# EAGLE design LoggerAVR (EAGLE 7.2.0)
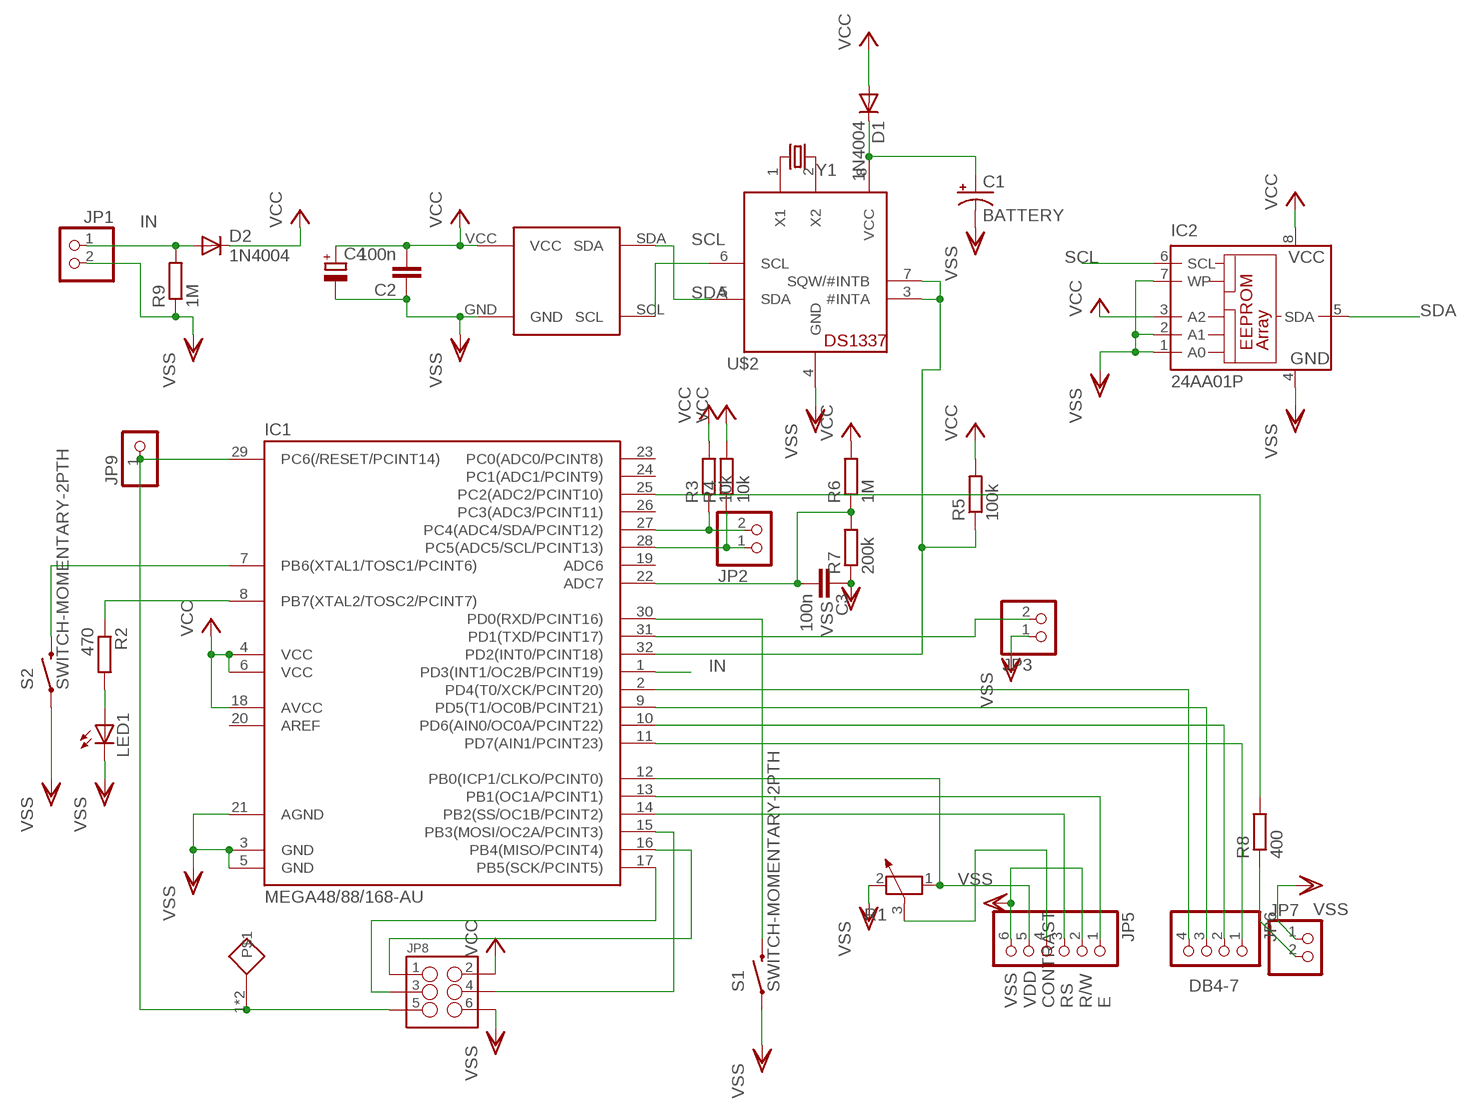
[diagram p0: schematic, sheet 1]

## Parts
C1  BATTERY  CPOL-USETR2  [ETR2]
C2  100n  C-EUC1206  [C1206]
C3  100n  C-EUC1206  [C1206]
C4  CPOL-EUE22-9AXIAL  [E22-9]
D1  1N4004  [DO41-10]
D2  1N4004  [DO41-10]
IC1  MEGA48/88/168-AU  [TQFP32-08]
IC2  24AA01P  [DIL8]
JP1  PINHD-1X2  [1X02]
JP2  PINHD-1X2  [1X02]
JP3  PINHD-1X2  [1X02]
JP5  PINHD-1X6  [1X06]
JP6  PINHD-1X4  [1X04]
JP7  PINHD-1X2  [1X02]
JP8  M03X2SHROUD  [2X3-SHROUDED]
JP9  PINHD-1X1  [1X01]
LED1  LEDSML1206  [SML1206]
R1  POTENTIOMETER_PT-10  [PT-10]
R2  470  R-EU_M1206  [M1206]
R3  10k  R-EU_M1206  [M1206]
R4  10k  R-EU_M1206  [M1206]
R5  100k  R-EU_M1206  [M1206]
R6  1M  R-EU_M1206  [M1206]
R7  200k  R-EU_M1206  [M1206]
R8  400  R-EU_M1206  [M1206]
R9  1M  R-EU_M1206  [M1206]
S1  SWITCH-MOMENTARY-2PTH  [TACTILE-PTH]
S2  SWITCH-MOMENTARY-2PTH  [TACTILE-PTH]
U$1  HYT939  [TO39]
U$2  DS1337  [DIL08-ROUND]
U$3  0 - Jump  O-OHMJUMPER  [R1206]
Y1  CRYSTAL32-SMD  [CRYSTAL-32KHZ-SMD]

## Nets
IN: D2.A IC1.1(PD3(INT1/OC2B/PCINT19)) JP1.1 R9.2
N$1: IC1.2(PD4(T0/XCK/PCINT20)) JP6.4
N$2: IC1.30(PD0(RXD/PCINT16)) S1.3 S1.4
N$3: IC1.9(PD5(T1/OC0B/PCINT21)) JP6.3
N$4: IC1.15(PB3(MOSI/OC2A/PCINT3)) JP8.4
N$5: IC1.16(PB4(MISO/PCINT4)) JP8.1
N$6: IC1.17(PB5(SCK/PCINT5)) JP8.3
N$7: IC1.29(PC6(/RESET/PCINT14)) JP8.5 JP9.1 U$3.1 U$3.2
N$8: IC1.10(PD6(AIN0/OC0A/PCINT22)) JP6.2
N$9: U$2.2(X2) Y1.X2
N$10: JP5.4 R1.3
N$11: IC1.11(PD7(AIN1/PCINT23)) JP6.1
N$12: IC1.13(PB1(OC1A/PCINT1)) JP5.1
N$13: IC1.14(PB2(SS/OC1B/PCINT2)) JP5.3
N$14: IC1.31(PD1(TXD/PCINT17)) JP3.2
N$15: IC1.7(PB6(XTAL1/TOSC1/PCINT6)) S2.3 S2.4
N$16: IC1.12(PB0(ICP1/CLKO/PCINT0)) JP5.5 R1.1
N$17: U$2.1(X1) Y1.X1
N$18: IC1.32(PD2(INT0/PCINT18)) R5.1 U$2.3(#INTA) U$2.7(SQW/#INTB)
N$19: IC1.8(PB7(XTAL2/TOSC2/PCINT7)) R2.1
N$20: LED1.A R2.2
N$21: C3.2 IC1.22(ADC7) R6.1 R7.2
N$22: C1.+ D1.C U$2.8(VCC)
N$23: IC1.25(PC2(ADC2/PCINT10)) R8.2
N$25: JP7.2 R8.1
SCL: IC1.28(PC5(ADC5/SCL/PCINT13)) IC2.6(SCL) JP2.1 R4.1 U$1.SCL U$2.6(SCL)
SDA: IC1.27(PC4(ADC4/SDA/PCINT12)) IC2.5(SDA) JP2.2 R3.1 U$1.SDA U$2.5(SDA)
VCC: C2.2 C4.+ D1.A D2.C IC1.4(VCC) IC1.6(VCC) IC1.18(AVCC) IC2.3(A2) IC2.8(VCC) JP8.2 R3.2 R4.2 R5.2 R6.2 U$1.VCC
VSS: C1.- C2.1 C3.1 C4.- IC1.3(GND) IC1.5(GND) IC1.21(AGND) IC2.1(A0) IC2.2(A1) IC2.4(GND) IC2.7(WP) JP1.2 JP3.1 JP5.2 JP5.6 JP7.1 JP8.6 LED1.C R1.2 R7.1 R9.1 S1.1 S1.2 S2.1 S2.2 U$1.GND U$2.4(GND)
Unconnected: IC1.19(ADC6) IC1.20(AREF) IC1.23(PC0(ADC0/PCINT8)) IC1.24(PC1(ADC1/PCINT9)) IC1.26(PC3(ADC3/PCINT11))

## Notes on the sheet
- DB4-7
- VSS
  VDD
  CONTRAST
  RS
  R/W
  E

## Library data of the parts
C1 = resistor:CPOL-US: POLARIZED CAPACITOR, American symbol
C2 C3 = rcl:C-EU: CAPACITOR, European symbol
C4 = rcl:CPOL-EU: POLARIZED CAPACITOR, European symbol
D1 D2 = adafruit:1N4004: DIODE General purpose 1N400x type rectifier (With bigger pads) http://www.ladyada.net/library/pcb/eaglelibrary.html
IC1 = avr-7:MEGA48/88/168
IC2 = microchip-5:24*: Serial EEPROM I2C
JP1-JP3 JP7 = pinhead:PINHD-1X2: PIN HEADER
JP5 = pinhead:PINHD-1X6: PIN HEADER
JP6 = pinhead:PINHD-1X4: PIN HEADER
JP8 = SparkFun-Connectors:M03X2: 2x3 .1" header. Shrouded, with keying- CONN-10681 SMT- CONN-11415 Pogo pins- HW-11044; PROD_ID: CONN-10681
JP9 = pinhead:PINHD-1X1: PIN HEADER
LED1 = led:LED: LED OSRAM: - CHIPLED LG R971, LG N971, LY N971, LG Q971, LY Q971, LO R971, LY R971 LH N974, LH R974 LS Q976, LO Q976, LY Q976 LO Q996 - Hyper CHIPLED LW Q18S LB Q993, LB Q99A, LB R99A - SideLED LS A670, LO A670, LY A670, LG A670, LP A670 LB A673, LV A673, LT A673, LW A673 LH A674 LY A675 LS A676, LA A676, LO A676, LY A676, LW A676 LS A679, LY A679, LG A679 - Hyper Micro SIDELED® LS Y876, LA Y876, LO Y876, LY Y876 LT Y87S - SmartLED LW L88C, LW L88S LB L89C, LB L89S, LG L890 LS L89K, LO L89K, LY L89K LS L896, LA L896, LO L896, LY L896 - TOPLED LS T670, LO T670, LY T670, LG T670, LP T670 LSG T670, LSP T670, LSY T670, LOP T670, LYG T670 LG T671, LOG T671, LSG T671 LB T673, LV T673, LT T673, LW T673 LH T674 LS T676, LA T676, LO T676, LY T676, LB T676, LH T676, LSB T676, LW T676 LB T67C, LV T67C, LT T67C, LS T67K, LO T67K, LY T67K, LW E67C LS E67B, LA E67B, LO E67B, LY E67B, LB E67C, LV E67C, LT E67C LW T67C LS T679, LY T679, LG T679 LS T770, LO T770, LY T770, LG T770, LP T770 LB T773, LV T773, LT T773, LW T773 LH T774 LS E675, LA E675, LY E675, LS T675 LS T776, LA T776, LO T776, LY T776, LB T776 LHGB T686 LT T68C, LB T68C - Hyper Mini TOPLED® LB M676 - Mini TOPLED Santana® LG M470 LS M47K, LO M47K, LY M47K Source: http://www.osram.convergy.de LUXEON: - LUMILED® LXK2-PW12-R00, LXK2-PW12-S00, LXK2-PW14-U00, LXK2-PW14-V00 LXK2-PM12-R00, LXK2-PM12-S00, LXK2-PM14-U00 LXK2-PE12-Q00, LXK2-PE12-R00, LXK2-PE12-S00, LXK2-PE14-T00, LXK2-PE14-U00 LXK2-PB12-K00, LXK2-PB12-L00, LXK2-PB12-M00, LXK2-PB14-N00, LXK2-PB14-P00, LXK2-PB14-Q00 LXK2-PR12-L00, LXK2-PR12-M00, LXK2-PR14-Q00, LXK2-PR14-R00 LXK2-PD12-Q00, LXK2-PD12-R00, LXK2-PD12-S00 LXK2-PH12-R00, LXK2-PH12-S00 LXK2-PL12-P00, LXK2-PL12-Q00, LXK2-PL12-R00 Source: www.luxeon.com KINGBRIGHT: KA-3528ASYC Source: www.kingbright.com
R1 = rcl:POTENTIOMETER_: Potentiometer
R2-R9 = rcl:R-EU_: RESISTOR, European symbol
S1 S2 = SparkFun-Electromechanical:SWITCH-MOMENTARY-2: Various NO switches- pushbuttons, reed, etc
U$1 = HYT939:HYT939
U$2 = adafruit:DS1337: DS1337 - Maxim RTC without battery backup
U$3 = rcl:O-OHMJUMPER
Y1 = SparkFun-FreqCtrl:CRYSTAL: Various standard crystals. Proven footprints. Spark Fun Electronics SKU : COM-00534; PROD_ID: XTAL-07894

## Board
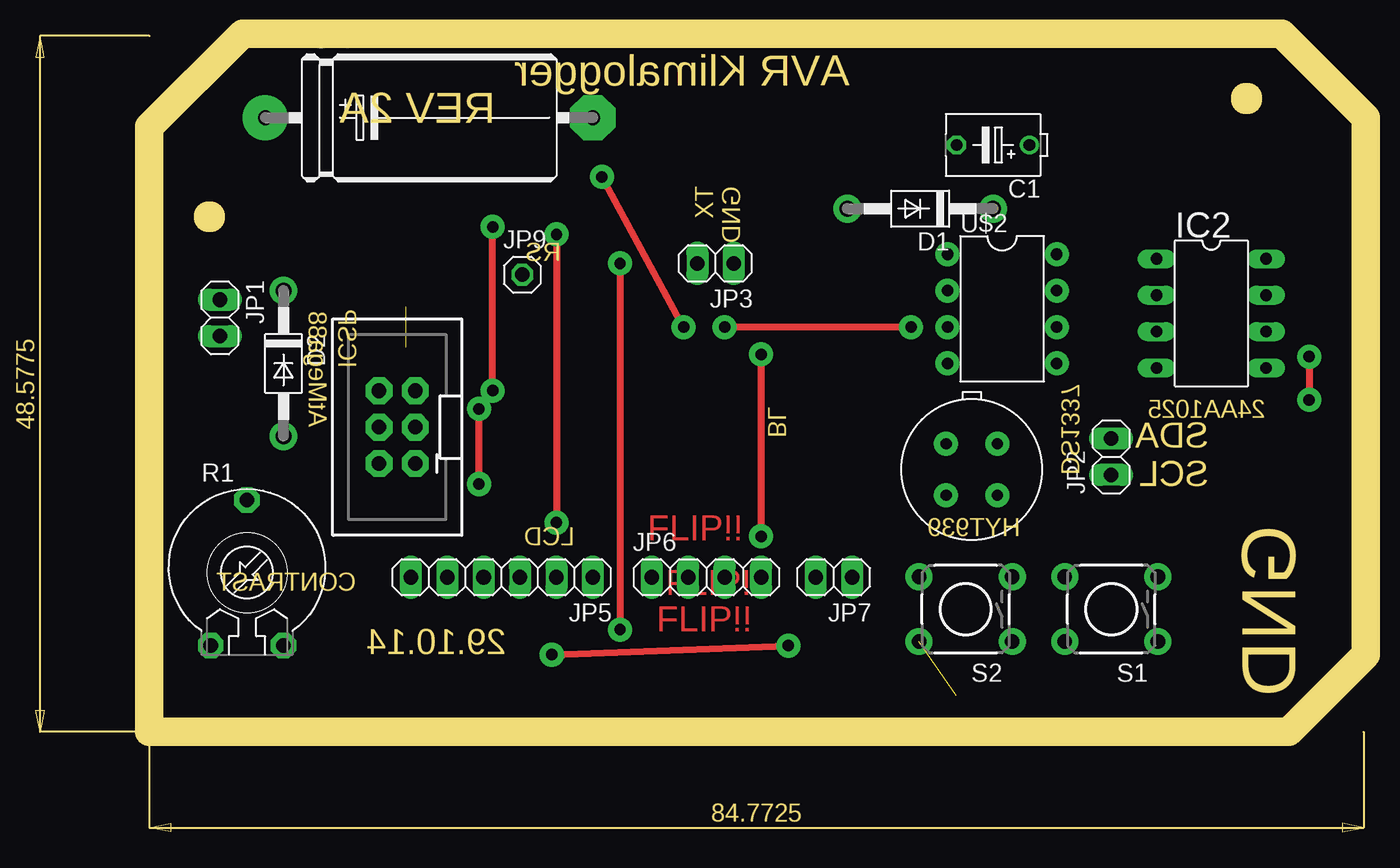
[diagram p1: board, top side]
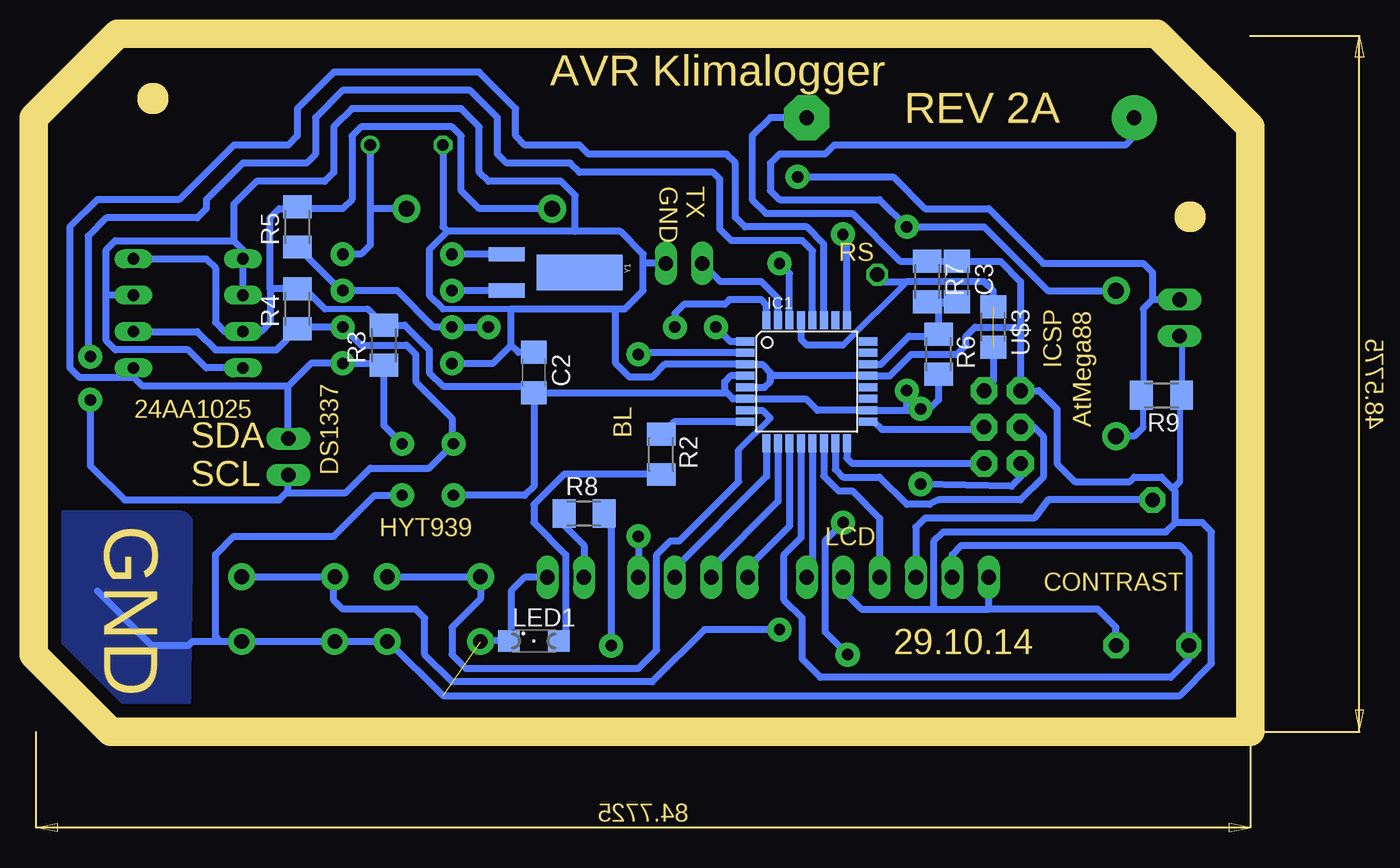
[diagram p2: board, bottom side, seen from below]

Size 83.34 x 47.15 mm. Coordinates in mm from the lower left corner, seen from the top.
Outline: 6.03,47.15 77.95,47.15 83.34,41.75 83.34,4.92 78.42,0 0,0 0,41.12 6.03,47.15
Copper layers (1*16): Top 0.035mm / dielectric 1.5mm / Bottom 0.035mm
Design rules "default": minimum track width 10mil, minimum drill 24mil, track to track 8mil, track to pad 8mil, pad to pad 8mil, via to via 8mil, smd to smd 8mil, copper to edge 40mil, drill to drill 8mil, minimum pad ring 10mil, minimum via ring 8mil, stop-mask expansion 4mil, vias tented up to drill 0mil, thermal gap 10mil
Milling: 15 lines

### Footprints (pad centres in the part's own frame; a part is rotated, then mirrored left to right if it is on the bottom)
ETR2 = drill 0.813: + -2.54,0 | drill 0.813 octagon: - 2.54,0
C1206 = smd 1.6 x 1.8: 1 -1.4,0; 2 1.4,0
E22-9 = drill 1.016 pad 3.15: + -11.43,0 | drill 1.016 pad 3.15 octagon: - 11.43,0
DO41-10 = drill 1.118 pad 1.93: A 5.08,0; C -5.08,0
TQFP32-08 = smd 1.27 x 0.559: 1 -4.293,2.8; 2 -4.293,2; 3 -4.293,1.2; 4 -4.293,0.4; 5 -4.293,-0.4; 6 -4.293,-1.2; 7 -4.293,-2; 8 -4.293,-2.8; 17 4.293,-2.8; 18 4.293,-2; 19 4.293,-1.2; 20 4.293,-0.4; 21 4.293,0.4; 22 4.293,1.2; 23 4.293,2; 24 4.293,2.8 | smd 0.559 x 1.27: 9 -2.8,-4.293; 10 -2,-4.293; 11 -1.2,-4.293; 12 -0.4,-4.293; 13 0.4,-4.293; 14 1.2,-4.293; 15 2,-4.293; 16 2.8,-4.293; 25 2.8,4.293; 26 2,4.293; 27 1.2,4.293; 28 0.4,4.293; 29 -0.4,4.293; 30 -1.2,4.293; 31 -2,4.293; 32 -2.8,4.293
DIL8 = drill 0.813 long: 1 -3.81,-3.81; 2 -1.27,-3.81; 3 1.27,-3.81; 4 3.81,-3.81; 5 3.81,3.81; 6 1.27,3.81; 7 -1.27,3.81; 8 -3.81,3.81
1X02 = drill 1.016 long: 1 -1.27,0; 2 1.27,0
1X06 = drill 1.016 long: 1 -6.35,0; 2 -3.81,0; 3 -1.27,0; 4 1.27,0; 5 3.81,0; 6 6.35,0
1X04 = drill 1.016 long: 1 -3.81,0; 2 -1.27,0; 3 1.27,0; 4 3.81,0
2X3-SHROUDED = drill 1.016 pad 1.88 octagon: 1 -1.27,2.54; 2 1.27,2.54; 3 -1.27,0; 4 1.27,0; 5 -1.27,-2.54; 6 1.27,-2.54
1X01 = drill 1.016 octagon: 1 0,0
SML1206 = smd 1.5 x 1.5: A 1.75,0; C -1.75,0
PT-10 = drill 1.016 pad 1.778 octagon: 1 -2.54,-5.08; 2 2.54,-5.08; 3 0,5.08
M1206 = smd 1.6 x 2: 1 -1.4,0; 2 1.4,0
TACTILE-PTH = drill 1.016 pad 1.88: 1 -3.251,2.261; 2 3.251,2.261; 3 -3.251,-2.261; 4 3.251,-2.261
TO39 = drill 0.8 pad 1.676: GND 2.213,-2.213; SCL -1.379,1.379; SDA 2.213,1.379; VCC -1.379,-2.213
DIL08-ROUND = drill 0.813 pad 1.676: 1 -3.81,-3.81; 2 -1.27,-3.81; 3 1.27,-3.81; 4 3.81,-3.81; 5 3.81,3.81; 6 1.27,3.81; 7 -1.27,3.81; 8 -3.81,3.81
R1206 = smd 1.6 x 1.803: 1 -1.422,0; 2 1.422,0
CRYSTAL-32KHZ-SMD = smd 2.5 x 6: SHEILD 0,5.08 | smd 1 x 2.5: X1 -1.27,0; X2 1.27,0

### Placement (x,y rotation side)
C1  58.1,40.16 180 top
C2  49.21,24.29 270 bottom
C3  19.69,30.64 270 bottom
C4  18.73,42.07 0 top
D1  53.02,35.72 180 top
D2  8.57,24.92 270 top
IC1  30.16,23.65 0 bottom
IC2  73.34,28.42 270 top
JP1  4.13,28.1 270 top
JP2  66.36,18.41 90 top
JP3  38.74,31.91 180 top
JP5  23.81,10 180 top
JP6  38.1,10 0 top
JP7  46.99,10 180 top
JP8  16.51,20.48 180 top
JP9  25.24,31.11 0 top
LED1  49.21,5.56 0 bottom
R1  6.03,10.32 0 top
R2  40.32,18.57 270 bottom
R3  59.69,26.19 90 bottom
R4  65.72,28.73 90 bottom
R5  65.72,34.45 90 bottom
R6  20.96,25.56 270 bottom
R7  21.75,30.64 270 bottom
R8  45.72,14.45 0 bottom
R9  5.4,22.7 180 bottom
S1  66.36,7.78 180 top
S2  56.2,7.78 180 top
U$1  56.2,17.94 0 top
U$2  58.74,28.73 270 top
U$3  17.15,27.46 270 bottom
Y1  51.12,31.27 270 bottom

### Tracks (layer width: path | path; a pad name or v marks a point on that pad's centre or on a via)
IN  (via drill 0.8 pad 1.68)
  Top 0.5: v36.51,27.46 v30.8,37.94
  Bottom 0.406: 6.67,28.73 6.67,22.83 R9.2 6.67,22.57 6.67,20.48
  Bottom 0.5: JP1.1 6.03,29.37 | 6.03,29.37 6.67,28.73 | 6.67,20.48 7.3,19.84 D2.A | IC1.1 35.5,26.45 v36.51,27.46 | v30.8,37.94 24.13,37.94 21.91,35.72 17.46,35.72 13.65,31.91 6.67,31.91 6.03,31.27 6.03,29.37
N$1  (via drill 0.8 pad 1.68)
  Top 0.5: v41.91,25.56 v41.91,12.86
  Bottom 0.5: IC1.2 41.82,25.65 v41.91,25.56 | v41.91,12.86 JP6.4
N$2  (via drill 0.8 pad 1.68)
  Top 0.5: v32.07,31.91 v32.07,6.35
  Bottom 0.5: S1.3 S1.4 63.18,9.96 63.18,8.41 62.55,7.78 57.47,7.78 56.83,7.14 56.83,4.6 54.93,2.7 40.96,2.7 37.31,6.35 v32.07,6.35 | IC1.30 31.36,31.2 v32.07,31.91
N$3
  Bottom 0.5: IC1.9 32.96,17.04 39.37,10.64 JP6.3
N$4
  Bottom 0.5: JP8.4 14.29,20.48 13.65,19.84 13.65,16.99 15.24,15.4 20.96,15.4 21.59,15.08 23.18,15.08 25.08,16.99 27.62,16.99 28.16,17.53 IC1.15
N$5
  Bottom 0.5: JP8.1 26.99,17.94 27.36,18.31 IC1.16
N$6
  Bottom 0.5: IC1.17 25.46,20.85 24.92,20.32 17.94,20.32 JP8.3
N$7  (1 unrouted)
  Bottom 0.4: 23.18,30.64 27.62,26.19
  Bottom 0.5: U$3.2 17.15,23.65 JP8.5 | 27.62,26.19 30.16,26.19 30.56,26.59 IC1.29 | U$3.1 17.15,30 17.78,30.64 23.18,30.64 24.77,30.64 JP9.1
N$8
  Bottom 0.5: IC1.10 32.16,15.3 36.83,10.64 JP6.2
N$9
  Bottom 0.5: Y1.X2 U$2.2
N$10
  Bottom 0.5: R1.3 13.34,15.4 14.29,14.13 21.91,14.13 22.54,13.49 JP5.4
N$11
  Bottom 0.5: IC1.11 31.36,13.56 34.29,10.64 JP6.1
N$12
  Bottom 0.5: IC1.13 29.76,11.35 JP5.1
N$13
  Bottom 0.5: IC1.14 28.96,17.06 27.94,16.03 26.99,16.03 25.08,14.13 JP5.3
N$14
  Bottom 0.5: IC1.31 32.16,29.46 33.34,30.64 36.19,30.64 JP3.2
N$15
  Bottom 0.4: 34.93,18.89 32.7,21.11
  Bottom 0.5: 34.93,18.89 34.93,16.67 39.05,12.54 39.69,12.54 40.64,11.59 40.64,4.92 41.91,3.65 53.97,3.65 54.93,4.6 54.93,6.51 52.95,8.49 S2.4 S2.3 | IC1.7 33.24,21.65 32.7,21.11
N$16
  Bottom 0.5: JP5.5 20,11.59 19.37,12.22 4.13,12.22 3.49,11.59 R1.1 3.49,4.29 4.76,3.02 29.21,3.02 30.48,4.29 30.48,7.14 31.75,8.41 31.75,11.59 30.56,12.78 IC1.12
N$17
  Bottom 0.5: Y1.X1 U$2.1
N$18  (via drill 0.8 pad 1.68)
  Top 0.5: v52.39,27.46 v39.37,27.46
  Bottom 0.5: R5.1 62.68,30 U$2.7 58.74,30 56.2,27.46 U$2.3 v52.39,27.46 | IC1.32 32.96,28.99 33.34,29.37 35.56,29.37 35.88,29.05 38.73,29.05 39.37,28.42 v39.37,27.46
N$19
  Bottom 0.5: IC1.8 39.44,20.85 R2.1
N$20
  Bottom 0.5: R2.2 47.12,17.17 49.21,15.08 49.21,13.81 46.99,11.59 46.99,6.03 LED1.A
N$21
  Bottom 0.305: R7.2 20.16,29.37 20.48,29.37 20.8,29.05 19.87,29.05 C3.2
  Bottom 0.5: IC1.22 24.99,24.85 23.02,26.83 21.09,26.83 R6.1 20.96,29.21 21.72,29.21 R7.2
N$22
  Bottom 0.5: C1.+ 60.64,35.72 | 60.64,35.72 60.64,33.18 61.28,32.54 U$2.8 | D1.C 60.64,35.72
N$23  (via drill 0.8 pad 1.68)
  Top 0.5: v27.64,33.93 27.64,13.82 v27.62,13.81 | v27.3,4.6 v43.82,5.24
  Bottom 0.5: IC1.25 27.36,33.66 v27.64,33.93 | v27.62,13.81 28.89,12.54 28.89,6.19 v27.3,4.6 | R8.2 44.32,14 43.82,13.49 v43.82,5.24
N$25
  Bottom 0.5: R8.1 47.12,13.62 45.72,12.22 JP7.2
SCL  (via drill 0.8 pad 1.68)
  Top 0.5: v80.17,25.4 v80.17,22.38
  Bottom 0.5: IC2.6 72.71,27.15 71.44,25.88 67.18,25.88 R4.1 65.59,27.46 U$2.6 61.28,26.19 58.1,26.19 57.47,25.56 57.47,23.65 54.93,21.11 54.93,19.43 U$1.SCL 56.51,17.62 60.64,17.62 62.39,15.87 66.36,15.87 JP2.1 66.36,16.03 66.99,15.4 77.79,15.4 80.17,17.78 v80.17,22.38 | IC1.28 29.76,32.78 30.48,33.5 35.43,33.5 36.23,34.29 36.23,37.78 36.7,38.26 46.04,38.26 46.67,38.89 51.12,38.89 51.75,39.53 51.75,42.07 53.66,43.97 62.55,43.97 64.45,42.07 64.45,39.53 65.09,38.89 69.53,38.89 72.07,36.35 72.07,35.72 72.71,35.08 79.06,35.08 80.33,33.81 80.33,25.56 v80.17,25.4
SDA
  Bottom 0.5: 66.36,23.34 64.77,24.92 U$2.5 59.82,24.92 R3.1 59.69,20.6 U$1.SDA | 66.36,23.34 76.52,23.34 77.15,23.97 | 77.15,23.97 IC2.5 | IC1.27 28.96,33.25 30.16,34.45 34.48,34.45 35.15,35.11 35.15,38.92 35.75,39.53 45.4,39.53 46.04,40.16 49.85,40.16 50.48,40.8 50.48,42.7 53.02,45.24 63.18,45.24 65.72,42.7 65.72,40.8 66.36,40.16 70.17,40.16 73.98,36.35 79.69,36.35 81.6,34.45 81.6,24.61 80.96,23.97 77.15,23.97 | JP2.2 66.36,23.34
VCC  (via drill 0.8 pad 1.68)
  Top 0.5: v22.23,16.51 v22.23,21.75 | v23.18,23.02 v23.18,34.45
  Bottom 0.42: 63.82,28.73 60.83,28.73
  Bottom 0.5: D1.A 53.02,35.72 54.29,36.99 54.29,40.8 54.93,41.43 61.28,41.43 61.91,40.8 61.91,36.35 62.55,35.72 65.59,35.72 R5.2 65.85,35.72 66.99,35.72 67.63,35.08 67.63,30.13 | 60.83,28.73 R3.2 58.23,27.59 56.51,25.88 56.51,24.29 55.56,23.34 49.66,23.34 C2.2 | 67.63,30.13 R4.2 65.22,30.13 63.82,28.73 | 67.63,30.13 67.63,27.78 68.26,27.15 IC2.3 70.8,27.15 71.44,27.78 71.44,31.59 72.07,32.23 IC2.8 | JP8.2 15.24,16.99 15.88,16.35 v22.23,16.51 | 23.18,21.65 IC1.18 29.43,21.65 30.23,22.45 IC1.6 35.31,22.45 35.88,23.02 | 23.18,21.65 22.32,21.65 v22.23,21.75 21.59,21.75 20.96,22.38 R6.2 | IC1.4 35.48,24.05 35.88,23.65 35.88,23.34 35.88,23.02 | 23.18,21.65 v23.18,23.02 | D2.C 13.34,30 17.78,34.45 v23.18,34.45 25.08,36.35 32.07,36.35 32.7,36.99 32.7,38.89 32.07,39.53 28.89,39.53 28.26,40.16 7.94,40.16 7.3,40.8 C4.+ | C2.2 49.21,16.35 49.85,15.72 54.81,15.72 U$1.VCC | C2.2 35.88,22.89 35.88,23.02
VSS  (1 unrouted)
  Bottom 0.305: C3.1 19.78,31.97 20.07,31.97
  Bottom 0.406: JP1.2 4,26.83 R9.1 4.13,22.7 4.13,16.67
  Bottom 0.42: 55.56,28.73 50.8,28.73
  Bottom 0.5: 43.5,28.73 50.8,28.73 50.8,26.19 | 43.5,28.73 42.86,28.73 41.59,30 41.59,31.91 | 41.59,31.91 41.59,32.54 43.18,34.13 46.33,34.13 | 46.33,34.13 55.25,34.13 | 55.25,34.13 56.51,32.86 56.51,29.69 55.56,28.73 | U$2.4 52.07,24.92 50.8,26.19 | C1.- 55.56,34.45 55.25,34.13 | IC2.2 IC2.1 69.53,32.86 70.17,33.5 | IC2.7 79.06,29.69 | 79.06,29.69 79.06,32.86 78.42,33.5 70.17,33.5 | 46.33,34.13 46.33,36.64 47.31,37.62 52.39,37.62 53.02,38.26 53.02,41.43 54.29,42.7 61.91,42.7 63.18,41.43 63.18,38.26 63.82,37.62 68.58,37.62 70.17,36.04 70.17,33.5 | IC2.4 72.07,24.61 73.34,25.88 78.42,25.88 79.06,26.51 79.06,29.69 | 32.7,24.29 33.27,24.85 IC1.3 40.08,24.85 40.96,23.97 42.55,23.97 43.5,24.92 43.5,28.73 | IC1.5 33.1,23.25 32.7,23.65 32.7,24.29 | JP5.2 27.62,9.05 26.35,7.78 21.27,7.78 | 21.27,7.78 17.46,7.78 | 17.46,7.78 JP5.6 | R1.2 8.57,6.51 9.84,7.78 17.46,7.78 | 21.27,7.78 21.27,12.54 20.64,13.18 5.08,13.18 4.45,13.81 | 4.45,13.81 4.45,16.03 4.6,16.19 | 4.6,16.19 5.4,16.99 7.3,16.99 7.62,16.67 11.43,16.67 12.7,17.94 12.7,21.75 13.97,23.02 JP8.6 15.24,27.46 | 32.7,24.29 32.47,24.05 IC1.21 24.37,24.05 22.86,25.56 19.69,25.56 19.05,26.19 19.05,26.83 18.42,27.46 15.24,27.46 | 20,32.04 R7.1 20.98,32.07 23.65,32.07 26.99,35.4 33.02,35.4 33.97,36.35 33.97,40.8 32.7,42.07 C4.- | 20,32.04 16.64,32.04 15.24,30.64 15.24,27.46 | 71.08,5.52 S1.1 S1.2 S2.1 59.33,5.52 55.56,1.75 4.13,1.75 1.91,3.97 1.91,13.18 2.54,13.81 4.45,13.81 | 71.08,5.52 71.44,5.87 71.44,11.59 70.17,12.86 63.18,12.86 60.33,15.72 U$1.GND | 4.13,16.67 4.6,16.19 | C2.1 50.3,25.69 50.8,26.19 | 20.13,31.91 20.07,31.97 20,32.04
  Bottom 0.5: JP3.1 41.59,31.91 | 71.08,5.52 73.06,5.52 73.34,5.24 75.88,5.24 79.69,9.05 | JP7.1 49.85,10 50.8,9.05 50.8,5.72 LED1.C 52.91,5.56 S2.2
  pour Bottom (isolate 0.06, rank 6): 73.98,13.65 74.14,0.16 78.42,0.16 83.5,5.24 83.34,13.65

### Text on the board
Top: FLIP!! | FLIP!! | FLIP!!
Milling: AVR Klimalogger | REV 2A | TX / GND | RS | AtMega88 | ICSP | 24AA1025 | BL | DS1337 | SDA / SCL | GND | LCD | HYT939 | CONTRAST | 29.10.14
_tsilk: TX / GND | RESET | DS1337 | +5V / / / / GND | 24AA1025 | BL | SDA / SCL | HYT939 | LCD | A / K | VSS / VDD / CON / RS / R/W / E | DB4 / DB5 / DB6 / DB7